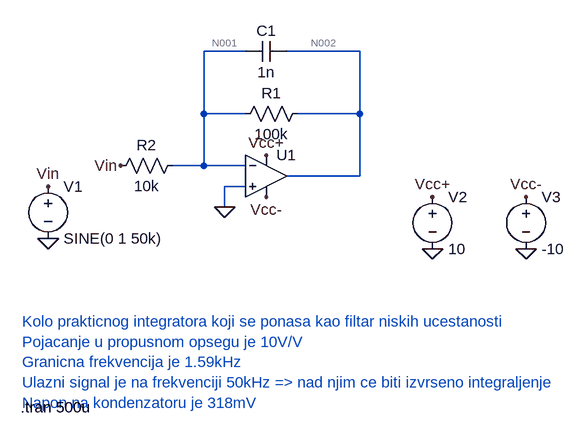
[diagram p0: schematic Draft1.asc]
Draft1.asc, the LTspice schematic file:
Version 4
SHEET 1 880 680
WIRE 112 -48 48 -48
WIRE 288 -48 176 -48
WIRE 48 48 48 -48
WIRE 112 48 48 48
WIRE 288 48 288 -48
WIRE 288 48 192 48
WIRE 48 128 48 48
WIRE 48 128 0 128
WIRE 112 128 48 128
WIRE 288 144 288 48
WIRE 288 144 176 144
WIRE 112 160 80 160
WIRE 80 192 80 160
FLAG -192 240 0
FLAG 400 256 0
FLAG 544 256 0
FLAG 400 176 Vcc+
FLAG 544 176 Vcc-
FLAG 144 176 Vcc-
FLAG 144 112 Vcc+
FLAG -192 160 Vin
FLAG -80 128 Vin
FLAG 80 192 0
SYMBOL OpAmps\\UniversalOpAmp2 144 144 R0
SYMATTR InstName U1
SYMBOL res 208 32 R90
WINDOW 0 0 56 VBottom 2
WINDOW 3 32 56 VTop 2
SYMATTR InstName R1
SYMATTR Value 100k
SYMBOL res 16 112 R90
WINDOW 0 0 56 VBottom 2
WINDOW 3 32 56 VTop 2
SYMATTR InstName R2
SYMATTR Value 10k
SYMBOL cap 176 -64 R90
WINDOW 0 0 32 VBottom 2
WINDOW 3 32 32 VTop 2
SYMATTR InstName C1
SYMATTR Value 1n
SYMATTR SpiceLine IC=318m
SYMBOL voltage -192 144 R0
WINDOW 123 0 0 Left 0
WINDOW 39 0 0 Left 0
SYMATTR InstName V1
SYMATTR Value SINE(0 1 50k)
SYMBOL voltage 400 160 R0
WINDOW 123 0 0 Left 0
WINDOW 39 0 0 Left 0
SYMATTR InstName V2
SYMATTR Value 10
SYMBOL voltage 544 160 R0
WINDOW 123 0 0 Left 0
WINDOW 39 0 0 Left 0
SYMATTR InstName V3
SYMATTR Value -10
TEXT -232 368 Left 2 ;Kolo prakticnog integratora koji se ponasa kao filtar niskih ucestanosti\nPojacanje u propusnom opsegu je 10V/V\nGranicna frekvencija je 1.59kHz\nUlazni signal je na frekvenciji 50kHz => nad njim ce biti izvrseno integraljenje\nNapon na kondenzatoru je 318mV
TEXT -234 500 Left 2 !.tran 500u

The netlist it stands for:
* Draft1.asc
XU1 0 N001 Vcc+ Vcc- N002 level2 Avol=1Meg GBW=10Meg Slew=10Meg Ilimit=25m Rail=0 Vos=0 En=0 Enk=0 In=0 Ink=0 Rin=500Meg  ; pins In+ In- V+ V- OUT
R1 N002 N001 100k
R2 N001 Vin 10k
C1 N002 N001 1n IC=318m
V1 Vin 0 SINE(0 1 50k)
V2 Vcc+ 0 10
V3 Vcc- 0 -10
* Kolo prakticnog integratora koji se ponasa kao filtar niskih ucestanosti
* Pojacanje u propusnom opsegu je 10V/V
* Granicna frekvencija je 1.59kHz
* Ulazni signal je na frekvenciji 50kHz => nad njim ce biti izvrseno integraljenje
* Napon na kondenzatoru je 318mV
.tran 500u
.lib UniversalOpAmp2.lib
.backanno
.end

* Results of the author's LTspice run, read from the files saved beside the schematic
* Operating Point, zero values left out:
*   V(n002) = 318 mV
*   V(vcc+) = 10 V
*   V(vcc-) = -10 V
*   V(n001) = -318.8 nV
*   I(C1) = -3.18 µA
*   I(R1) = 3.18 µA
*   I(R2) = -31.88 pA
*   I(V1) = -31.88 pA
*   I(V2) = -999 µA
*   I(V3) = 999 µA
*   Ix(u1:3) = 999 µA
*   Ix(u1:4) = -999 µA
*   Ix(u1:5) = 31.88 pA
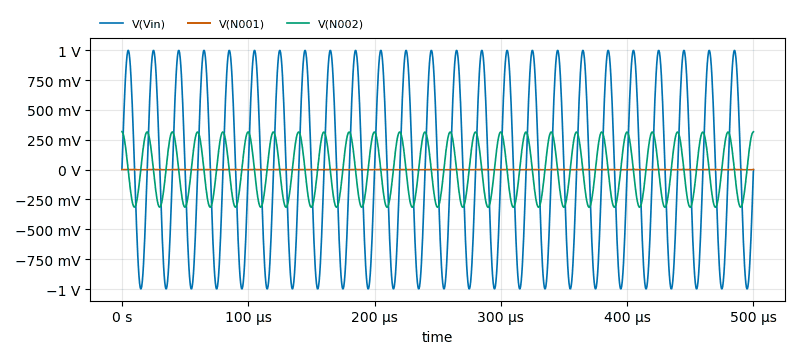
[diagram p1: Transient Analysis of Draft1.asc, plotted from the saved traces]
* Transient Analysis, 1 run:
*   V(Vin): min -998.2 mV, max 999.1 mV, average 206.6 nV, rms 707.2 mV, last 0 V
*   V(N001): min -1.586 mV, max 1.587 mV, average 33.99 nV, rms 1.12 mV, last 47.88 µV
*   V(N002): min -314.9 mV, max 318 mV, average 220.6 µV, rms 222.9 mV, last 317 mV